# Altium schematic sheet 原理图_上底板.schdoc
size 199 x 116 mm
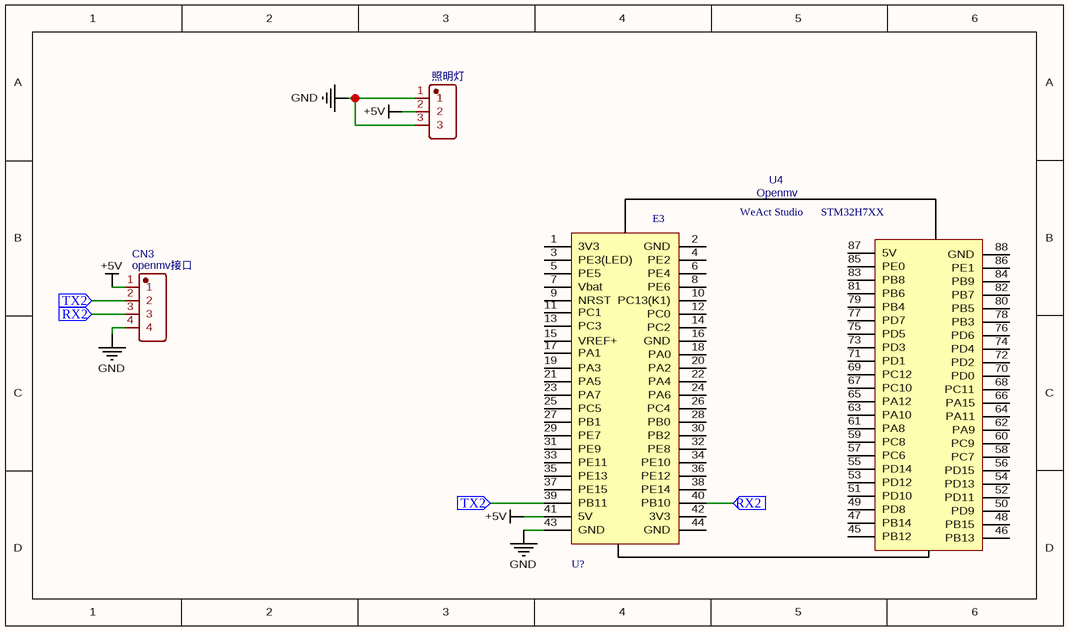
[diagram p0: 原理图_上底板.schdoc]

## Parts
1  照明灯  [HDR-TH_3P-P2.54-V-F]
CN3  openmv接口  [HDR-TH_4P-P2.54-V-F]
U4  Openmv  [STM32H7XX_WEACT_COREBOARD]

## Ports
RX2 (in), TX2 (in)

## Nets
+5V: 1.2 CN3.1 U4.41(5V)
GND: 1.1 1.3 CN3.4 U4.43(GND)
RX2: CN3.3 U4.40(PB10) ; port RX2
TX2: CN3.2 U4.39(PB11) ; port TX2

Not connected (* = marked no-connect by the designer): U4 1(3V3) 2(GND) 3(PE3(LED)) 4(PE2) 5(PE5) 6(PE4) 7(Vbat) 8(PE6) 9(NRST) 10(PC13(K1)) 11(PC1) 12(PC0) 13(PC3) 14(PC2) 15(VREF+) 16(GND) 17(PA1) 18(PA0) 19(PA3) 20(PA2) 21(PA5) 22(PA4) 23(PA7) 24(PA6) 25(PC5) 26(PC4) 27(PB1) 28(PB0) 29(PE7) 30(PB2) 31(PE9) 32(PE8) 33(PE11) 34(PE10) 35(PE13) 36(PE12) 37(PE15) 38(PE14) 42(3V3) 44(GND) 45(PB12) 46(PB13) 47(PB14) 48(PB15) 49(PD8) 50(PD9) 51(PD10) 52(PD11) 53(PD12) 54(PD13) 55(PD14) 56(PD15) 57(PC6) 58(PC7) 59(PC8) 60(PC9) 61(PA8) 62(PA9) 63(PA10) 64(PA11) 65(PA12) 66(PA15) 67(PC10) 68(PC11) 69(PC12) 70(PD0) 71(PD1) 72(PD2) 73(PD3) 74(PD4) 75(PD5) 76(PD6) 77(PD7) 78(PB3) 79(PB4) 80(PB5) 81(PB6) 82(PB7) 83(PB8) 84(PB9) 85(PE0) 86(PE1) 87(5V) 88(GND)

## Notes on the sheet
- (in symbol Openmv) WeAct Studio; STM32H7XX; E3; U?

## Library data of the parts
1 = 照明灯: BOM_Manufacturer: null; BOM_Manufacturer Part: PinSocket_1x03_P2.54mm_Vertical; Contributor: LCSC; BOM_Supplier: LCSC; BOM_Supplier Part: C9900002703; LINK: https://img.jlc.com/pdf/applyPasteComponent/2021-11-29/208559D/b25eee3aee4e4e7ea894ac6be7827652/PM254-1x3.pdf; BOM_JLCPCB Part Class: Extended Part; spicePre: U; spiceSymbolName: PINSOCKET_1X03_P2.54MM_VERTICAL
CN3 = openmv接口: BOM_Manufacturer: null; BOM_Manufacturer Part: JTAG; Contributor: LCSC; BOM_Supplier: LCSC; BOM_Supplier Part: C9900002996; BOM_JLCPCB Part Class: Extended Part; spicePre: C; spiceSymbolName: JTAG
U4 = Openmv: Contributor: Eaglewzw; BOM_Supplier: WeAct; spicePre: U; spiceSymbolName: STM32H7xxWeActStudioCoreBoard